# EasyEDA schematic SCH_KSGER T12 STM32_2023-10-02.json
TITLE: KSGER STM32 T12 Ver. 2.1S; REV: 1.0; Date: 2023-10-01; Sheet: 1/1; Drawn By: Frederik Koepsell; Company: ---
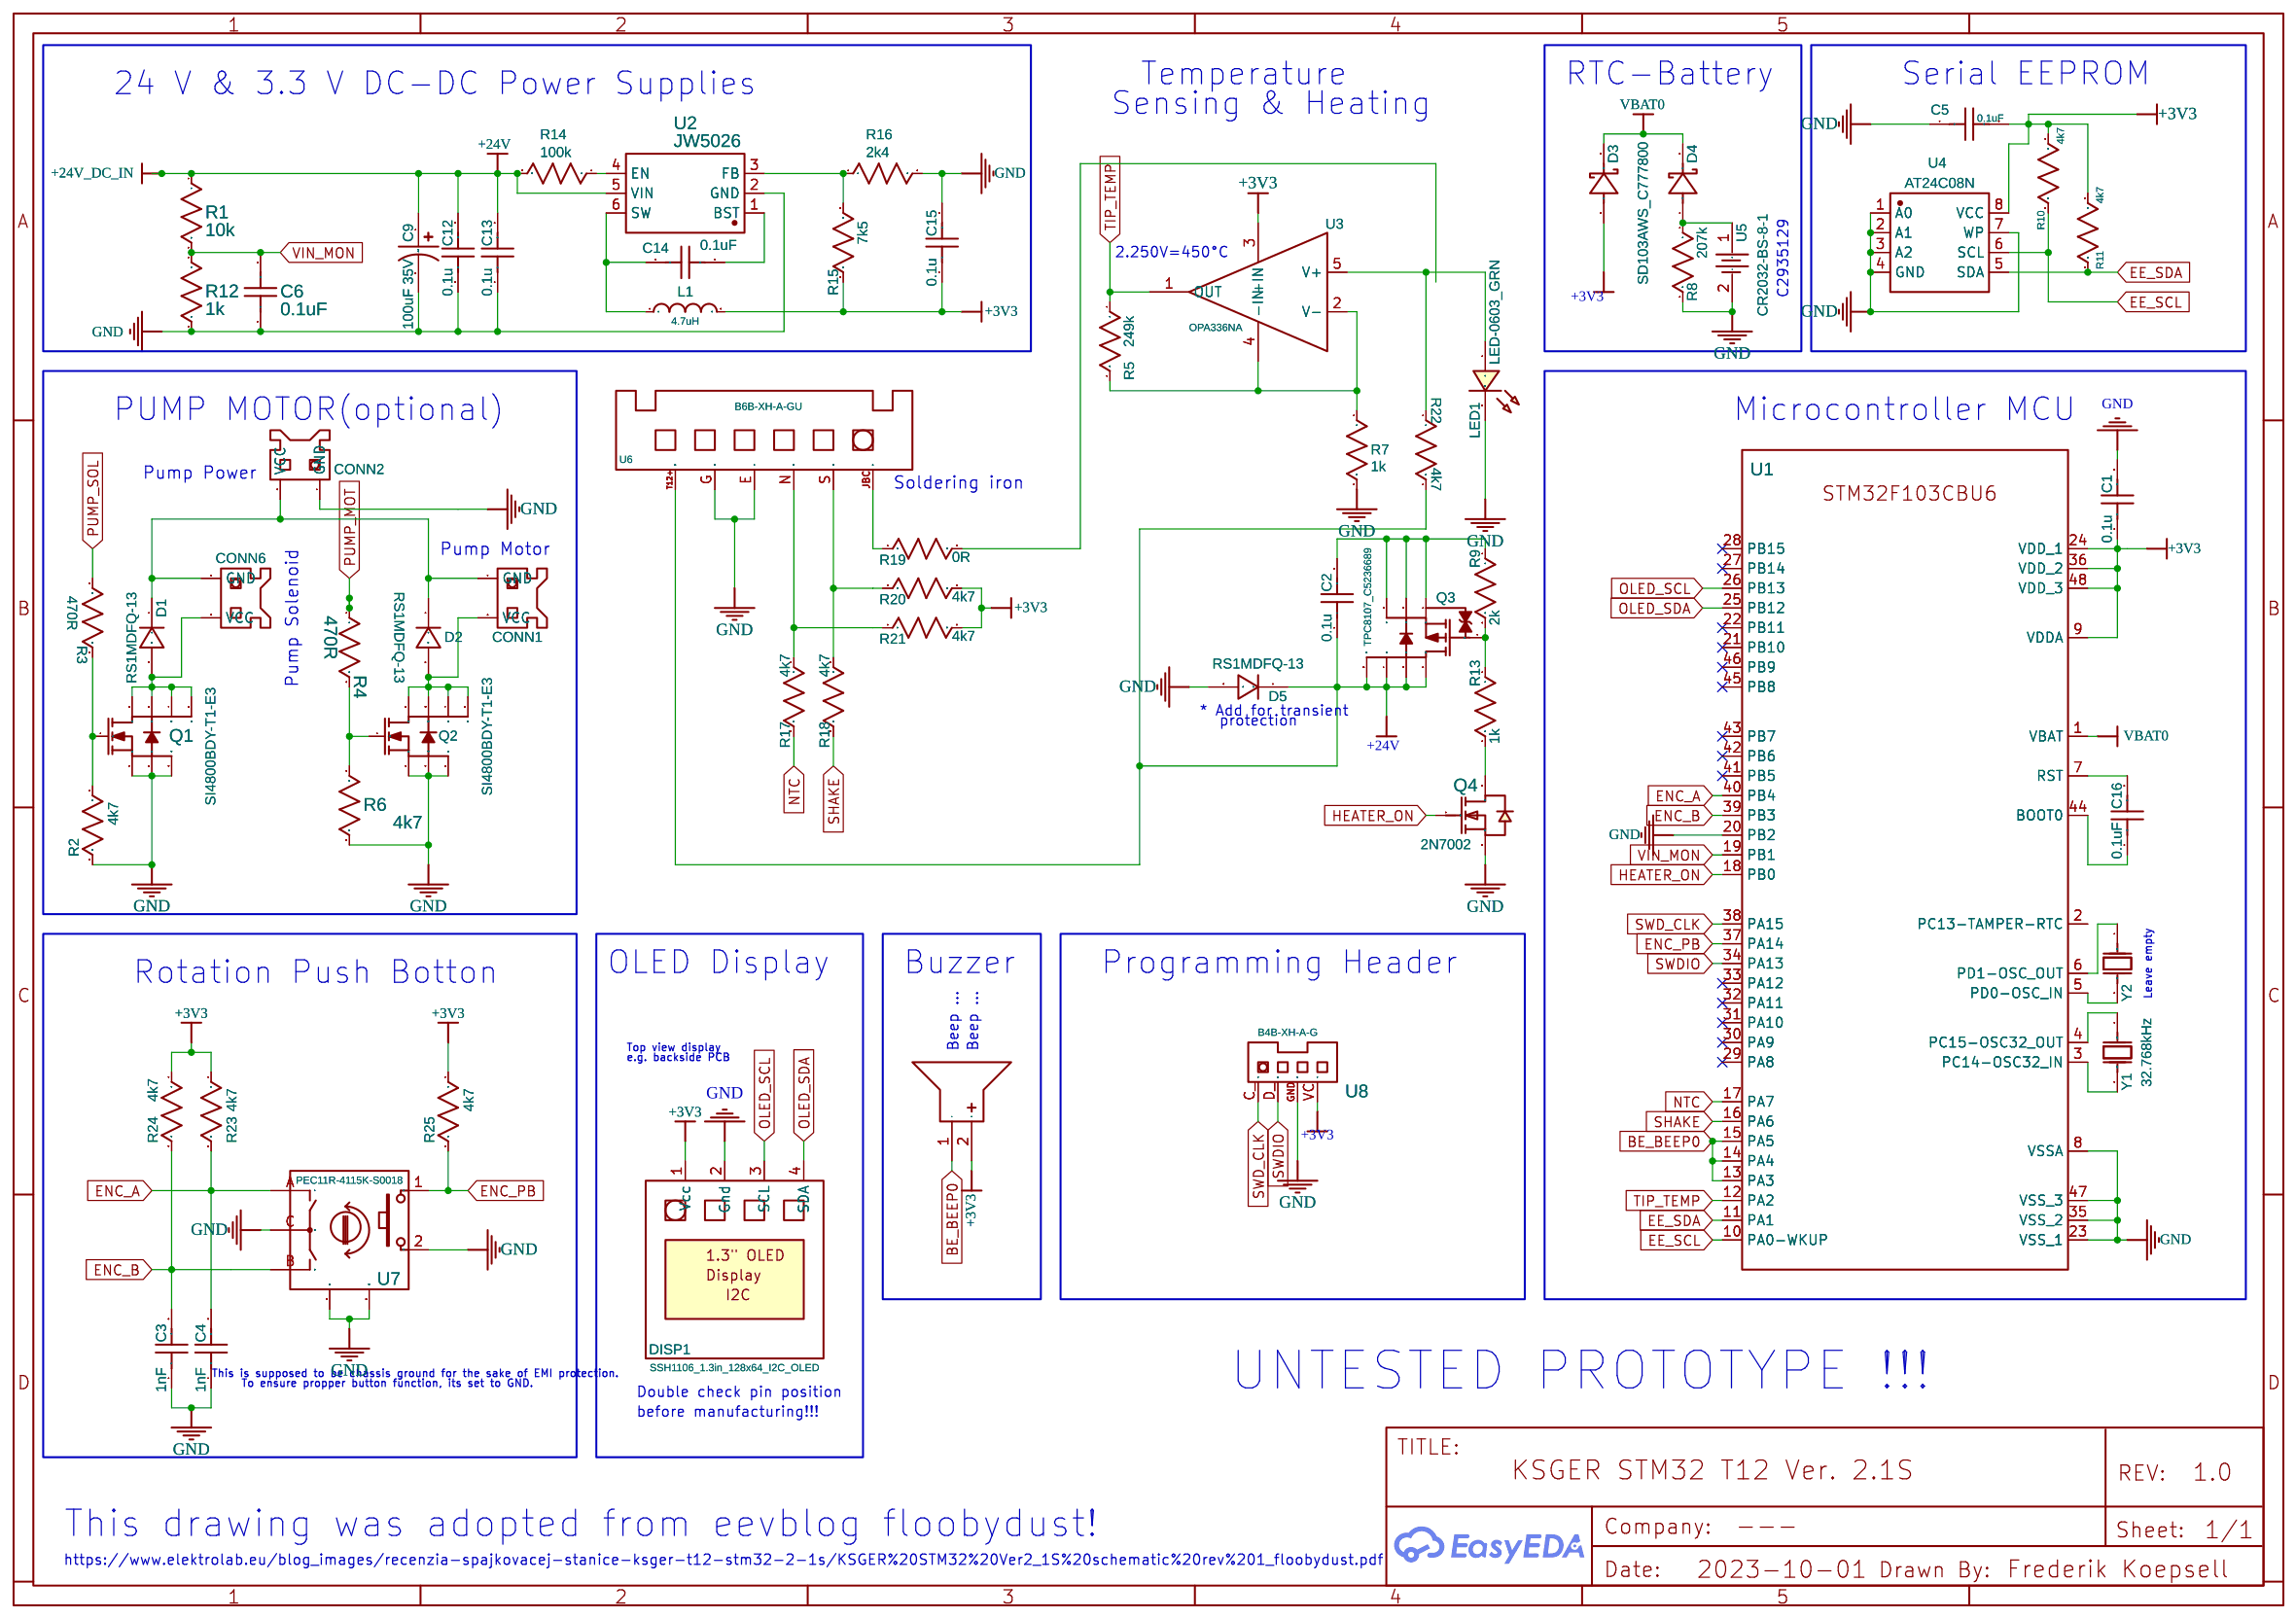
[diagram p0: schematic sheet]

## Parts
BUZZER1  BUZZER  [BUZ-TH_BD12.0-P6.00-D0.9-RD]
C1  0.1u  [C0603]
C2  0.1u  [C0603]
C3  1nF  [C0603]
C4  1nF  [C0603]
C5  0.1uF  [C0603]
C6  0.1uF  [C0603]
C9  100uF 35V  [CASE-A_3216]
C12  0.1u  [C0603]
C13  0.1u  [C0603]
C14  0.1uF  [C0603]
C15  0.1u  [C0603]
C16  0.1uF  [C0603]
CONN1  2_PIN_POWER_CONNECTOR_pitch_2.54_mm  [CONN-TH_2P-P2.54-V]
CONN2  2_PIN_POWER_CONNECTOR_pitch_2.54_mm  [CONN-TH_2P-P2.54-V]
CONN6  2_PIN_POWER_CONNECTOR_pitch_2.54_mm  [CONN-TH_2P-P2.54-V]
D1  RS1MDFQ-13  [D-FLAT_L4.3-W2.6-LS5.3-RD]
D2  RS1MDFQ-13  [D-FLAT_L4.3-W2.6-LS5.3-RD]
D3  SD103AWS_C777800  [SOD-323_L1.8-W1.3-LS2.5-FD]
D4  SD103AWS_C777800  [SOD-323_L1.8-W1.3-LS2.5-FD]
D5  RS1MDFQ-13  [D-FLAT_L4.3-W2.6-LS5.3-RD]
DISP1  SSH1106_1.3in_128x64_I2C_OLED  [SSH1106 1.3IN 128X64 I2C (HOLES)]
L1  4.7uH  [IND-SMD_L11.5-W10.5]
LED1  LED-0603_GRN  [LED0603_RED]
Q1  SI4800BDY-T1-E3  [SO-8_L4.9-W3.9-P1.27-LS6.0-BL]
Q2  SI4800BDY-T1-E3  [SO-8_L4.9-W3.9-P1.27-LS6.0-BL]
Q3  TPC8107_C5236689  [SOP-8_L4.9-W3.9-P1.27-LS6.0-BL]
Q4  2N7002  [SOT-23_L2.9-W1.3-P0.95-LS2.4-BR]
R1  10k  [R0603]
R2  4k7  [R0603]
R3  470R  [R0603]
R4  470R  [R0603]
R5  249k  [R0603]
R6  4k7  [R0603]
R7  1k  [R0603]
R8  207k  [R0603]
R9  2k  [R0603]
R10  4k7  [R0603]
R11  4k7  [R0603]
R12  1k  [R0603]
R13  1k  [R0603]
R14  100k  [R0603]
R15  7k5  [R0603]
R16  2k4  [R0603]
R17  4k7  [R0603]
R18  4k7  [R0603]
R19  0R  [R0603]
R20  4k7  [R0603]
R21  4k7  [R0603]
R22  4k7  [R0603]
R23  4k7  [R0603]
R24  4k7  [R0603]
R25  4k7  [R0603]
U1  STM32F103CBU6  [UFQFPN-48_L7.0-W7.0-P0.50-BL-EP]
U2  JW5026  [SOT-23-6_L2.9-W1.6-P0.95-LS2.8-BR]
U3  OPA336NA  [SOT-23-5_L3.0-W1.7-P0.95-LS2.8-BL]
U4  AT24C08N  [DIP-8_L9.2-W6.3-P2.54-LS7.62-BL]
U5  CR2032-BS-8-1  [BAT-SMD_CR2032-BS-8-1]
U6  B6B-XH-A-GU  [CONN-TH_B6B-XH-A-GU]
U7  PEC11R-4115K-S0018  [SW-TH_PEC11R-4XXXF-SXXXX]
U8  B4B-XH-A-G  [CONN-TH_B4B-XH-A-G]
Y1  32.768kHz  [CRYSTAL-SMD_L1.6-W1.0]
Y2  32.768kHz  [CRYSTAL-SMD_L1.6-W1.0]

## Library data of the parts
BUZZER1 = BUZZER: Contributor: lcsc; Supplier: LCSC; Supplier Part: C9900014030; Manufacturer: null; JLCPCB Part Class: Extended Part
C1-C6 C12-C16 = C_0603_US: Contributor: LCEDA_Lib
C9 = C_Tan_SMD_A_US: Contributor: LCEDA_Lib
CONN1 CONN2 CONN6 = 2_PIN_POWER_CONNECTOR_pitch_2.54_mm: Contributor: Frederik Koepsell; Supplier: LCSC; Supplier Part: C9900015105; Manufacturer: null; JLCPCB Part Class: Extended Part
D1 D2 D5 = RS1MDFQ-13: Contributor: LCSC; Supplier Part: C155394; Supplier: LCSC; Manufacturer: DIODES(美台); JLCPCB Part Class: Extended Part
D3 D4 = SD103AWS_C777800: Contributor: LCSC; Supplier: LCSC; Supplier Part: C777800; Manufacturer: HT(金誉); JLCPCB Part Class: Extended Part
DISP1 = SSH1106_1.3in_128x64_I2C_OLED: Manufacturer Part: Tribium; Contributor: Frederik Koepsell
L1 = MJC-1040T-4R7-M: Contributor: LCSC; Supplier: LCSC; Supplier Part: C2934965; Manufacturer: Me-TECH(美台高科)
LED1 = LED-0603_R: Manufacturer: EVERLIGHT(台湾亿光); Manufacturer Part: 19-217/R6C-AL1M2VY/3T; Supplier Part: C72044; Supplier: LCSC; Contributor: LCEDA_01
Q1 Q2 = SI4800BDY-T1-E3: Contributor: lcsc; Supplier: LCSC; Supplier Part: C4355101; Manufacturer: VBsemi(微碧)
Q3 = TPC8107_C5236689: Contributor: lcsc; Supplier: LCSC; Supplier Part: C5236689; Manufacturer: UMW(广东友台半导体)
Q4 = 2N7002: Supplier: LCSC; Manufacturer: Nexperia; Manufacturer Part: 2N7002,215; image: //image.lceda.cn/szlcsc/C65189.jpg; Supplier Part: C65189; Paste Type: expand; Contributor: LCEDA_Lib
R1-R25 = R_0603_US: Contributor: LCEDA_Lib
U1 = STM32F103C8T6: Supplier: LCSC; Manufacturer: ST; LCSC Assembly: Yes; image: //image.lceda.cn/szlcsc/C8734.jpg; Supplier Part: C55506; SMT Type: Basic; Contributor: Frederik Koepsell
U2 = JW5026: Contributor: LCSC; Supplier: LCSC; Supplier Part: C185109; Manufacturer: Joulwatt(杰华特); JLCPCB Part Class: Extended Part
U3 = OPA336NA: Supplier: LCSC; Manufacturer: TI(德州仪器); Supplier Part: C51037; JLCPCB Part Class: Extended Part; link: https://www.ti.com/lit/ds/sbos068c/sbos068c.pdf; Contributor: Frederik Koepsell
U4 = AT24C08N: Contributor: LCSC; Supplier: LCSC; Supplier Part: C434604; Manufacturer: HGSEMI; JLCPCB Part Class: Extended Part
U5 = CR2032-BS-8-1_C2935129: Contributor: LCSC; Supplier: LCSC; Supplier Part: C2935129; Manufacturer: null; JLCPCB Part Class: Extended Part
U6 = B6B-XH-A-GU: Contributor: Frederik Koepsell; Manufacturer: JST; JLCPCB Part Class: Extended Part
U7 = PEC11R-4115K-S0018: Contributor: lcsc; Supplier: LCSC; Supplier Part: C9900016250; Manufacturer: null; JLCPCB Part Class: Extended Part
U8 = B4B-XH-A-G: Contributor: Frederik Koepsell; Manufacturer: JST; JLCPCB Part Class: Extended Part
Y1 Y2 = NX1610SA-32.768KHZ-EXS00A-MU00658: Contributor: LCSC; Supplier: LCSC; Supplier Part: C1987116; Manufacturer: NDK; JLCPCB Part Class: Extended Part

## Nets
+3V3: BUZZER1.2(+) C1.1 C5.2 C15.1 D3.1(A) DISP1.1(Vcc) L1.2 R10.1 R11.1 R15.2 R20.2 R21.2 R23.1 R24.1 R25.1 U1.9(VDDA) U1.24(VDD_1) U1.36(VDD_2) U1.48(VDD_3) U3.3(+IN) U4.8(VCC) U8.VC(4)
+24V: C2.1 C9.1 C12.2 C13.2 D5.1 Q3.5(D) Q3.6(D) Q3.7(D) Q3.8(D) R1.1 R14.2 R22.2 U2.5(VIN) U6.T12+(6)
GND: C1.2 C3.1 C4.1 C5.1 C6.1 C9.2 C12.1 C13.1 C15.2 CONN2.1(GND) D5.2 DISP1.2(Gnd) LED1.2 Q1.1(S) Q1.2(S) Q1.3(S) Q2.1(S) Q2.2(S) Q2.3(S) Q4.2(S) R2.2 R6.2 R7.2 R8.2 R12.2 R16.2 U1.8(VSSA) U1.20(PB2) U1.23(VSS_1) U1.35(VSS_2) U1.47(VSS_3) U2.2(GND) U4.1(A0) U4.2(A1) U4.3(A2) U4.4(GND) U4.7(WP) U5.2(-) U6.E(4) U6.G(5) U7.2 U7.C U7.MT1 U7.MT2 U8.GND(3)
VBAT0: D3.2(K) D4.2(K) U1.1(VBAT)
VIN_MON: C6.2 R1.2 R12.1 U1.19(PB1)
BE_BEEP0: BUZZER1.1(-) U1.13(PA3) U1.14(PA4) U1.15(PA5)
EE_SCL: R10.2 U1.10(PA0-WKUP) U4.6(SCL)
EE_SDA: R11.2 U1.11(PA1) U4.5(SDA)
ENC_A: C4.2 R23.2 U1.40(PB4) U7.A
ENC_B: C3.2 R24.2 U1.39(PB3) U7.B
ENC_PB: R25.2 U1.37(PA14) U7.1
HEATER_ON: Q4.1(G) U1.18(PB0)
NTC: R17.2 U1.17(PA7)
OLED_SCL: DISP1.3(SCL) U1.26(PB13)
OLED_SDA: DISP1.4(SDA) U1.25(PB12)
PUMP_MOT: R4.1
PUMP_SOL: R3.1
SHAKE: R18.2 U1.16(PA6)
SWD_CLK: U1.38(PA15) U8.C_(1)
SWDIO: U1.34(PA13) U8.D_(2)
TIP_TEMP: R5.1 U1.12(PA2) U3.1(OUT)
Net-(C2-2): C2.2 Q3.1(S) Q3.2(S) Q3.3(S) R9.1
Net-(C14-1): C14.1 U2.1(BST)
Net-(C14-2): C14.2 L1.1 U2.6(SW)
Net-(C16-1): C16.1 U1.44(BOOT0)
Net-(C16-2): C16.2 U1.7(RST)
Net-(CONN1-1): CONN1.1(GND) CONN2.2(VCC) CONN6.1(GND) D1.1 D2.1
Net-(CONN1-2): CONN1.2(VCC) D2.2 Q2.5(D) Q2.6(D) Q2.7(D) Q2.8(D)
Net-(CONN6-2): CONN6.2(VCC) D1.2 Q1.5(D) Q1.6(D) Q1.7(D) Q1.8(D)
Net-(D4-1): D4.1(A) R8.1 U5.1(+)
Net-(LED1-1): LED1.1 R22.1 U3.5(V+)
Net-(Q1-4): Q1.4(G) R2.1 R3.2
Net-(Q2-4): Q2.4(G) R4.2 R6.1
Net-(Q3-4): Q3.4(G) R9.2 R13.1
Net-(Q4-3): Q4.3(D) R13.2
Net-(R5-2): R5.2 R7.1 U3.2(V-) U3.4(-IN)
Net-(R14-1): R14.1 U2.4(EN)
Net-(R15-1): R15.1 R16.1 U2.3(FB)
Net-(R17-1): R17.1 R21.1 U6.N(3)
Net-(R18-1): R18.1 R20.1 U6.S(2)
Net-(R19-1): R19.1 U6.JBC(1)
Net-(U1-3): U1.3(PC14-OSC32_IN) Y1.2(OSC2)
Net-(U1-4): U1.4(PC15-OSC32_OUT) Y1.1(OSC1)
Net-(U1-5): U1.5(PD0-OSC_IN) Y2.2(OSC2)
Net-(U1-6): U1.6(PD1-OSC_OUT) Y2.1(OSC1)

Not connected (* = marked no-connect by the designer): R19 2; U1 2(PC13-TAMPER-RTC) 21(PB10)* 22(PB11)* 27(PB14)* 28(PB15)* 29(PA8)* 30(PA9)* 31(PA10)* 32(PA11)* 33(PA12)* 41(PB5)* 42(PB6)* 43(PB7)* 45(PB8)* 46(PB9)*

## Notes on the sheet
- 24 V & 3.3 V DC-DC Power Supplies
- Temperature
- RTC-Battery
- Serial EEPROM
- Sensing & Heating
- 2.250V=450°C
- C2935129
- PUMP MOTOR(optional)
- Microcontroller MCU
- Pump Power
- Soldering iron
- Pump Motor
- Pump Solenoid
- * Add for transient
- protection
- OLED Display
- Buzzer
- Programming Header
- Rotation Push Botton
- Leave empty
- Top view display
- Beep ...
- Beep ...
- e.g. backside PCB
- UNTESTED PROTOTYPE !!!
- This is supposed to be chassis ground for the sake of EMI protection.
- To ensure propper button function, its set to GND.
- Double check pin position
- before manufacturing!!!
- This drawing was adopted from eevblog floobydust!
- https://www.elektrolab.eu/blog_images/recenzia-spajkovacej-stanice-ksger-t12-stm32-2-1s/KSGER%20STM32%20Ver2_1S%20schematic%20rev%201_floobydust.pdf
